# EAGLE board 6502_R8 (EAGLE 7.5.0)
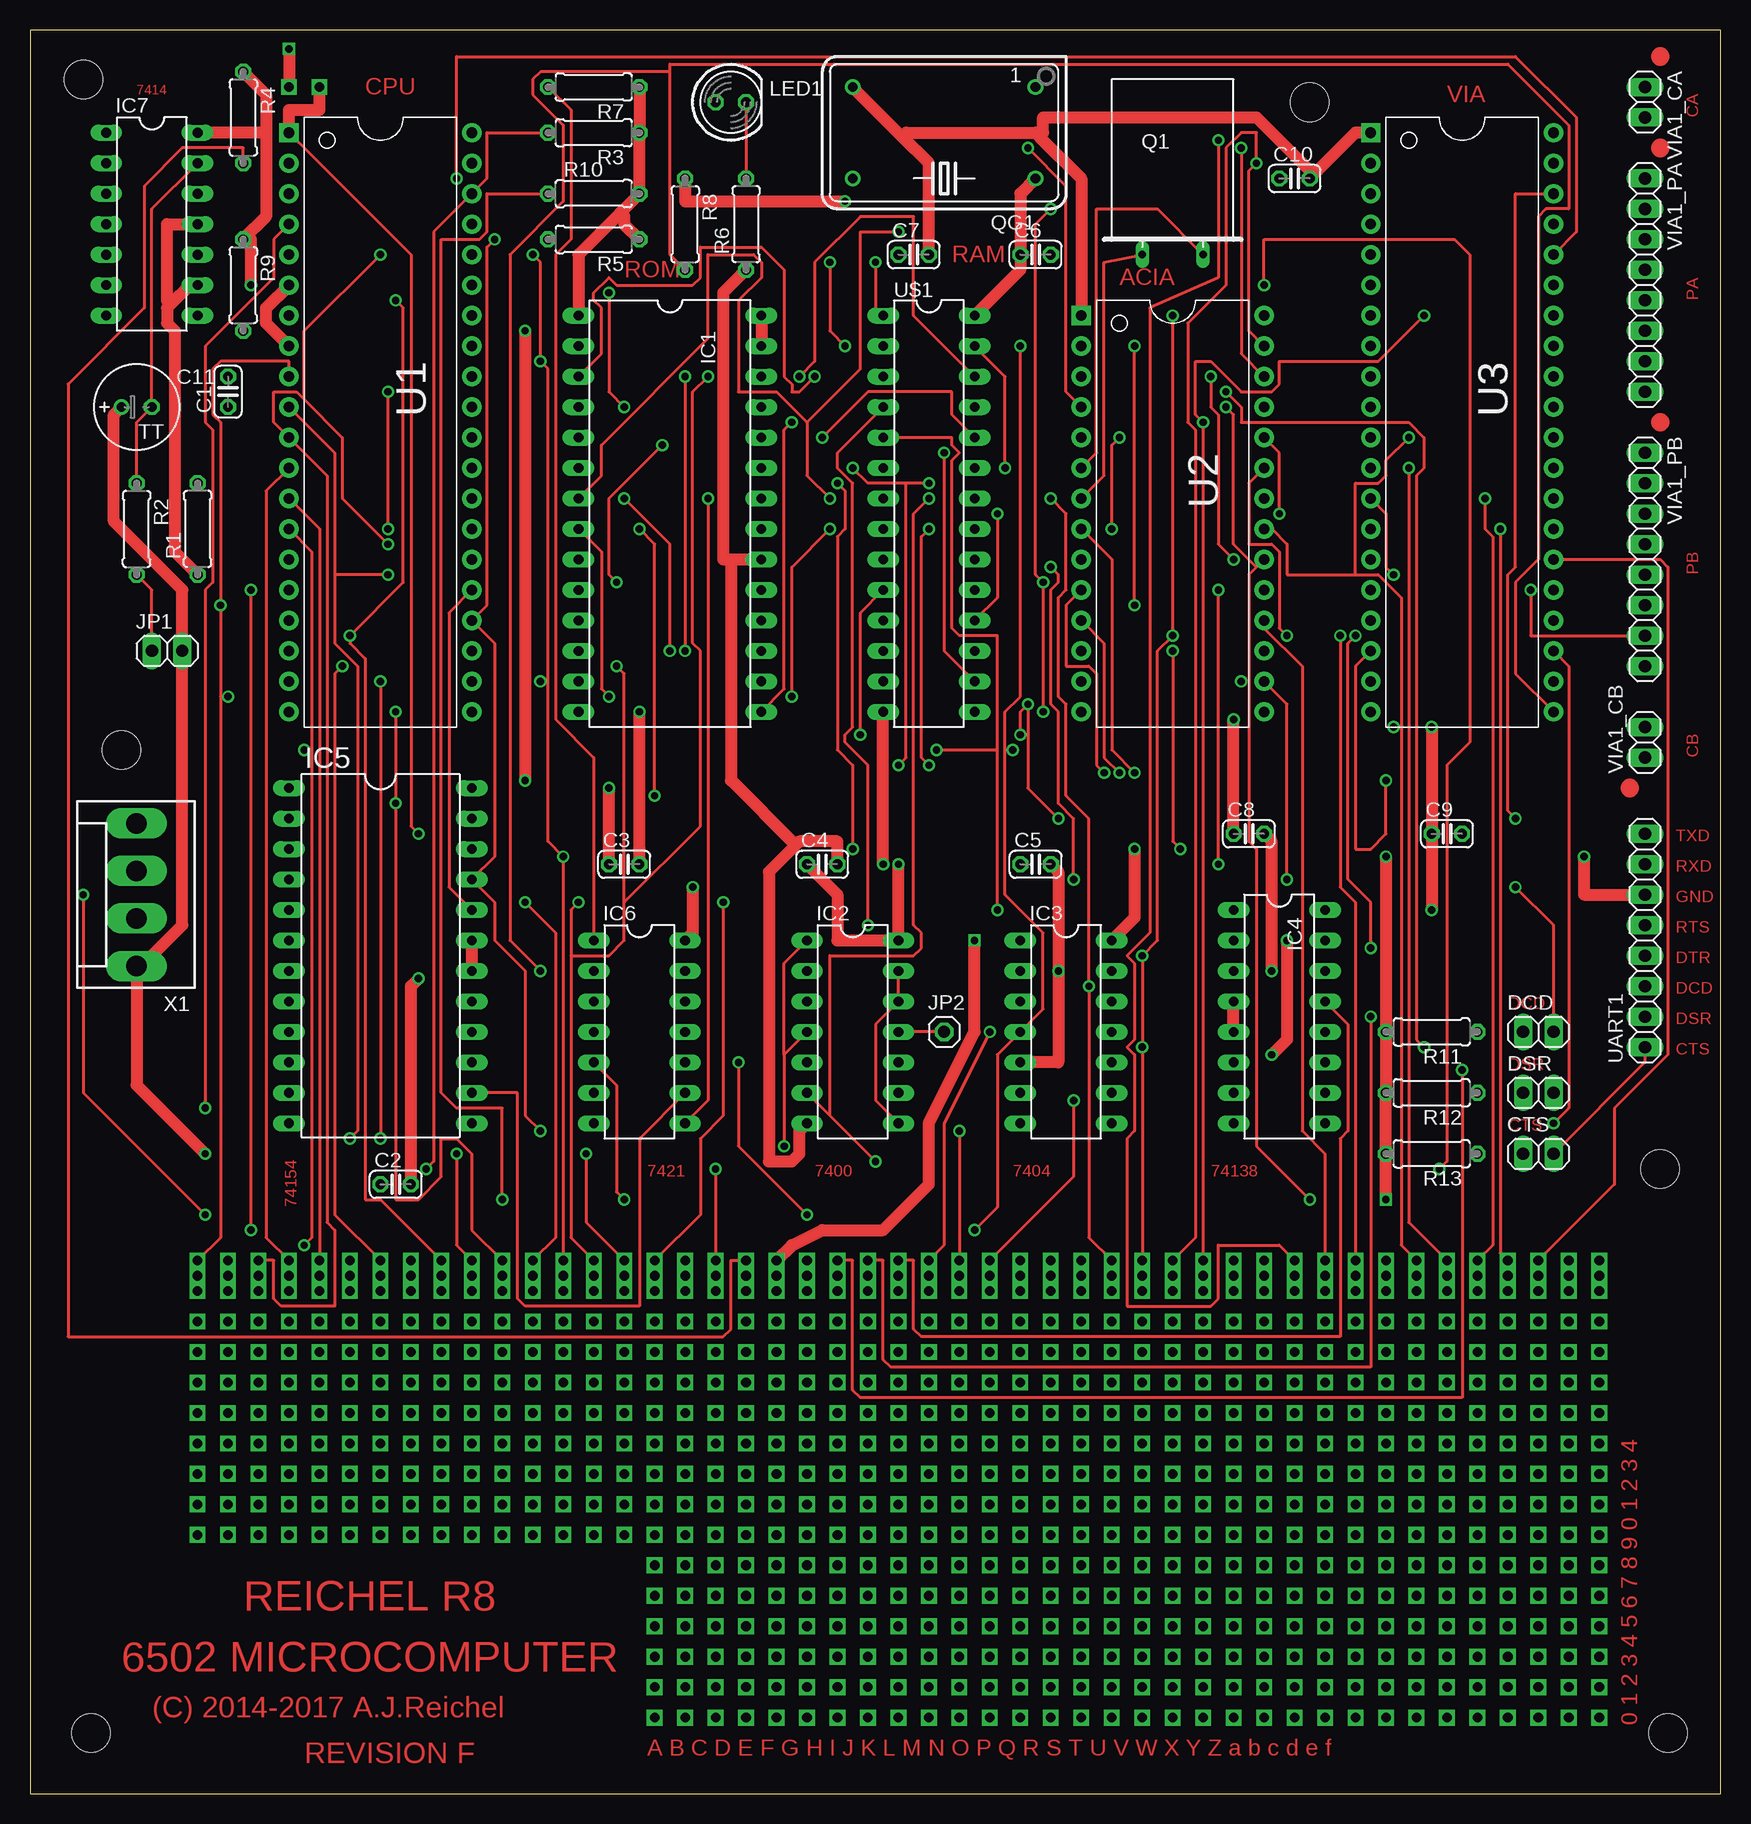
[diagram p1: board, top side]
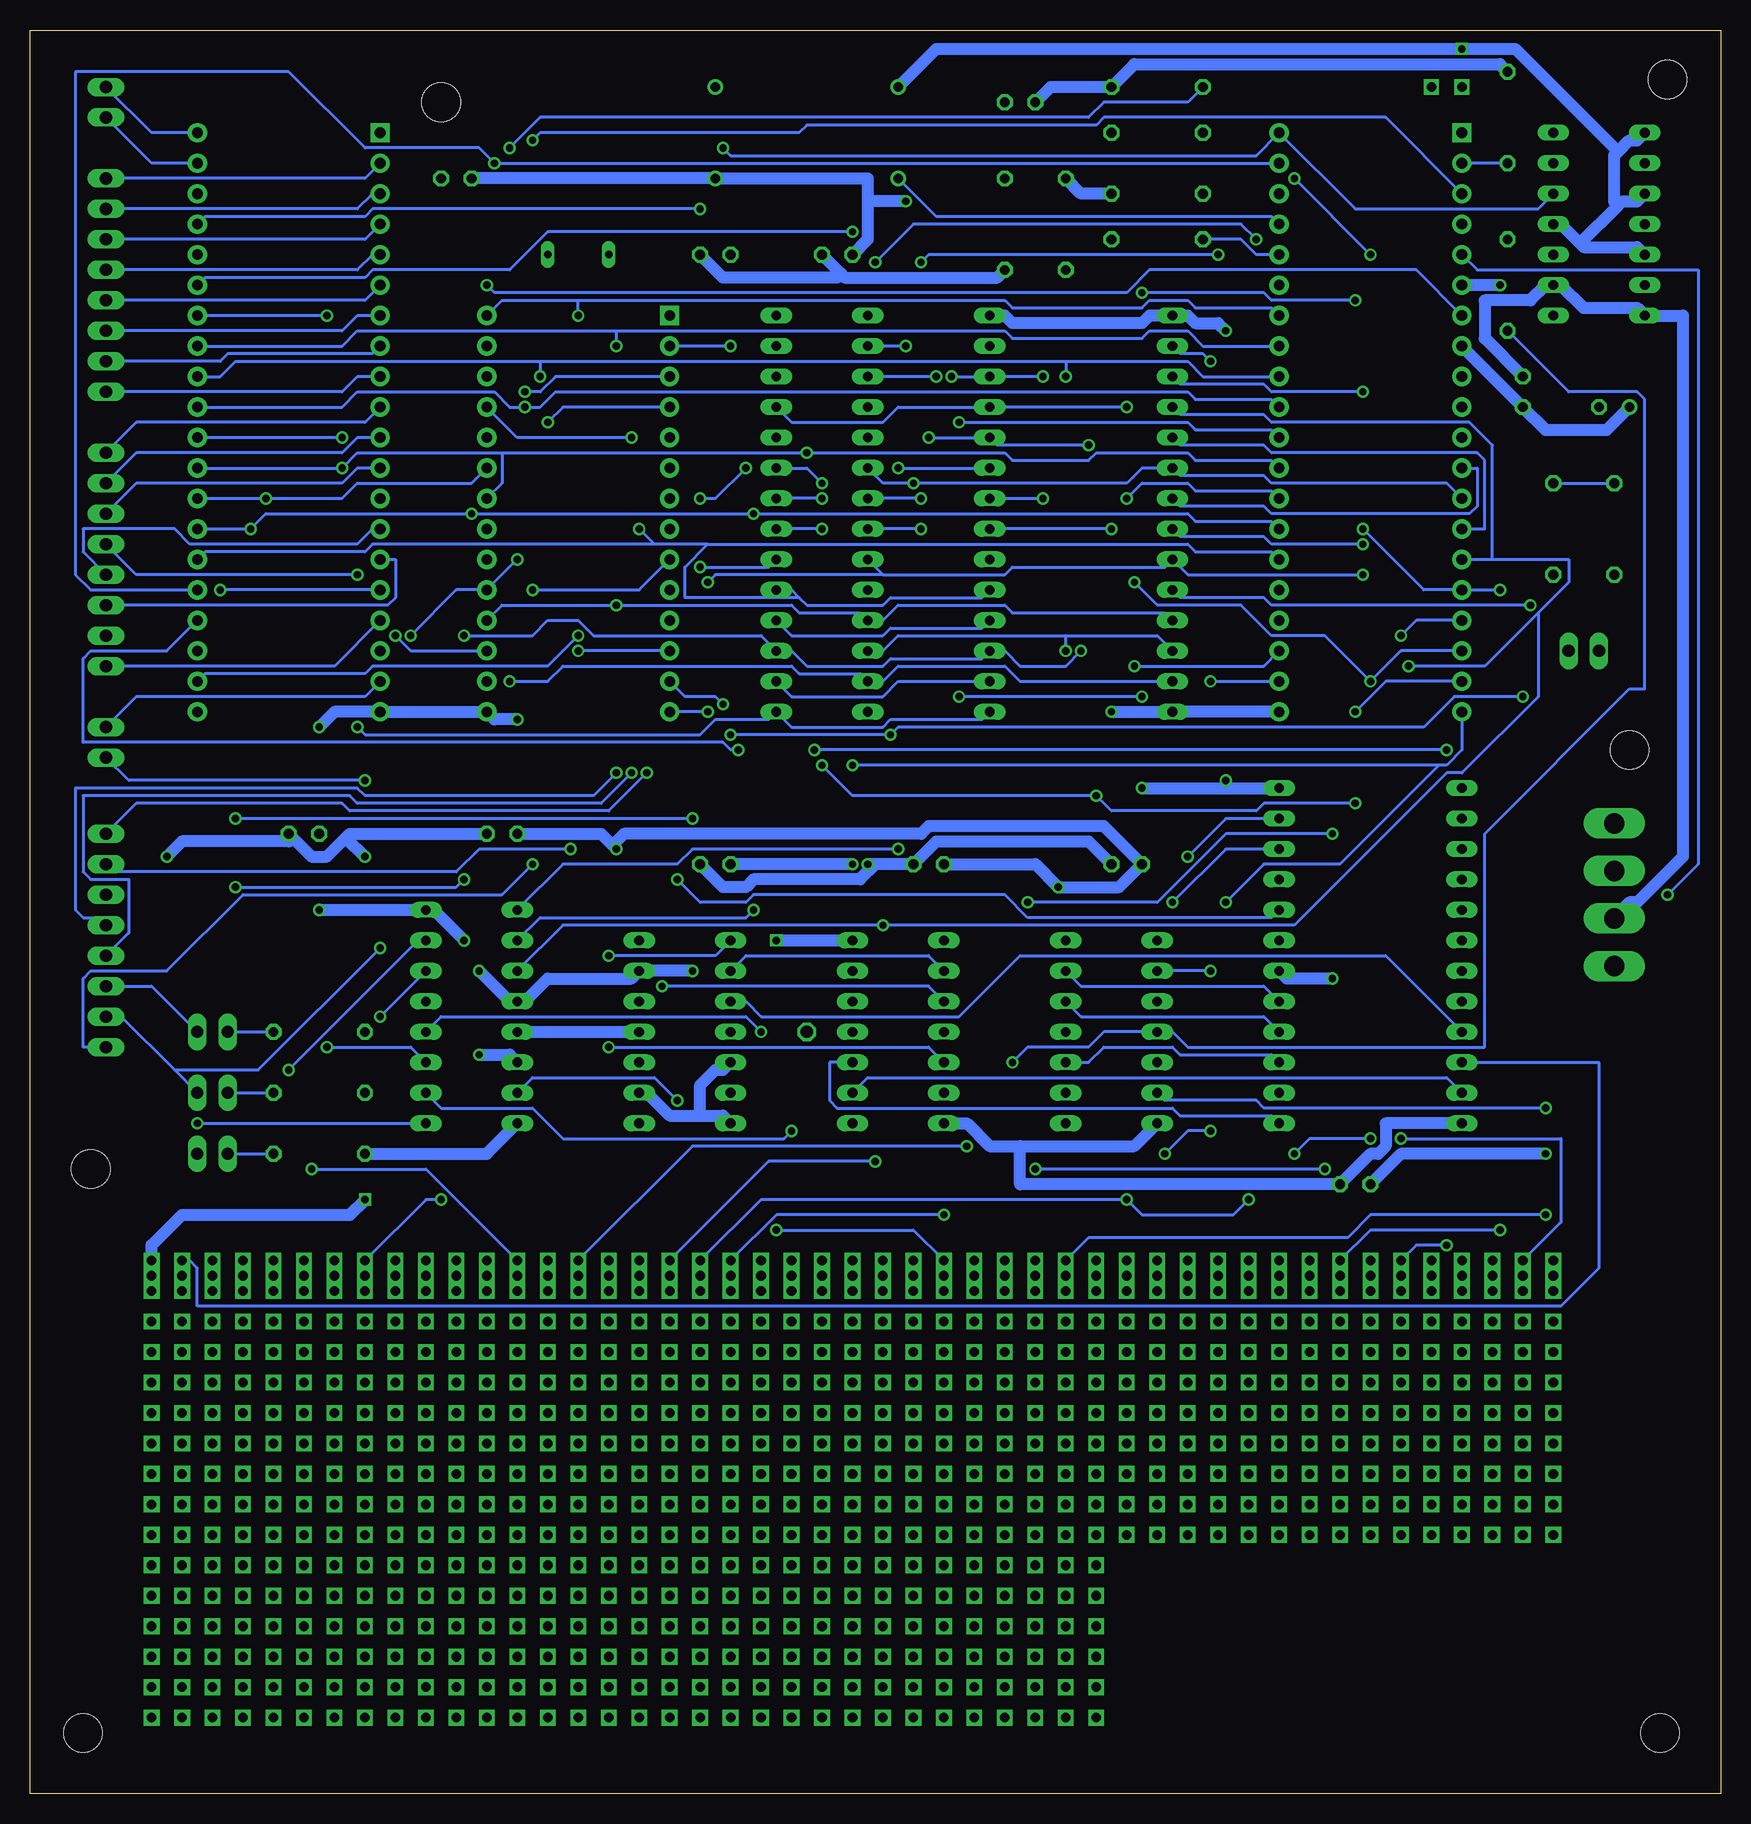
[diagram p2: board, bottom side, seen from below]

Size 140.95 x 146.99 mm. Coordinates in mm from the lower left corner, seen from the top.
Outline: 0,0 140.95,0 140.95,146.99 0,146.99 0,0
Copper layers (1*16): Top 0.035mm / dielectric 1.5mm / Bottom 0.035mm
Design rules "default *": minimum track width 10mil, minimum drill 24mil, track to track 8mil, track to pad 8mil, pad to pad 8mil, via to via 8mil, smd to smd 8mil, copper to edge 40mil, drill to drill 8mil, minimum pad ring 10mil, minimum via ring 8mil, stop-mask expansion 4mil, vias tented up to drill 0mil, thermal gap 10mil
Net classes: 1 Power: width 1.016 mm, drill 0.508 mm, clearance 0.254 mm
Holes 3.2 mm at 5.08,5.08 7.62,87 136.53,5.08 135.89,52.07 106.68,140.97 4.45,142.88

## Footprints (pad centres in the part's own frame; a part is rotated, then mirrored left to right if it is on the bottom)
C025-024X044 = drill 0.813 octagon: 1 -1.27,0; 2 1.27,0
TT2D7 = drill 0.813: + -1.27,0 | drill 0.813 octagon: - 1.27,0
1X02 = drill 1.016 long: 1 -1.27,0; 2 1.27,0
DIL28 = drill 0.813 long: 1 -16.51,-7.62; 2 -13.97,-7.62; 3 -11.43,-7.62; 4 -8.89,-7.62; 5 -6.35,-7.62; 6 -3.81,-7.62; 7 -1.27,-7.62; 8 1.27,-7.62; 9 3.81,-7.62; 10 6.35,-7.62; 11 8.89,-7.62; 12 11.43,-7.62; 13 13.97,-7.62; 14 16.51,-7.62; 15 16.51,7.62; 16 13.97,7.62; 17 11.43,7.62; 18 8.89,7.62; 19 6.35,7.62; 20 3.81,7.62; 21 1.27,7.62; 22 -1.27,7.62; 23 -3.81,7.62; 24 -6.35,7.62; 25 -8.89,7.62; 26 -11.43,7.62; 27 -13.97,7.62; 28 -16.51,7.62
DIL14 = drill 0.813 long: 1 -7.62,-3.81; 2 -5.08,-3.81; 3 -2.54,-3.81; 4 0,-3.81; 5 2.54,-3.81; 6 5.08,-3.81; 7 7.62,-3.81; 8 7.62,3.81; 9 5.08,3.81; 10 2.54,3.81; 11 0,3.81; 12 -2.54,3.81; 13 -5.08,3.81; 14 -7.62,3.81
DIL16 = drill 0.813 long: 1 -8.89,-3.81; 2 -6.35,-3.81; 3 -3.81,-3.81; 4 -1.27,-3.81; 5 1.27,-3.81; 6 3.81,-3.81; 7 6.35,-3.81; 8 8.89,-3.81; 9 8.89,3.81; 10 6.35,3.81; 11 3.81,3.81; 12 1.27,3.81; 13 -1.27,3.81; 14 -3.81,3.81; 15 -6.35,3.81; 16 -8.89,3.81
DIL24-6 = drill 0.813 long: 1 -13.97,-7.62; 2 -11.43,-7.62; 3 -8.89,-7.62; 4 -6.35,-7.62; 5 -3.81,-7.62; 6 -1.27,-7.62; 7 1.27,-7.62; 8 3.81,-7.62; 9 6.35,-7.62; 10 8.89,-7.62; 11 11.43,-7.62; 12 13.97,-7.62; 13 13.97,7.62; 14 11.43,7.62; 15 8.89,7.62; 16 6.35,7.62; 17 3.81,7.62; 18 1.27,7.62; 19 -1.27,7.62; 20 -3.81,7.62; 21 -6.35,7.62; 22 -8.89,7.62; 23 -11.43,7.62; 24 -13.97,7.62
1X01 = drill 1.016 octagon: 1 0,0
LED5MM = drill 0.813 octagon: A -1.27,0; K 1.27,0
Q = drill 0.61 long: 1 -2.54,-7.62; 2 2.54,-7.62
DIL14S = drill 0.813: 1 -7.62,-3.81; 7 7.62,-3.81; 8 7.62,3.81; 14 -7.62,3.81
0207/7 = drill 0.813 octagon: 1 -3.81,0; 2 3.81,0
DIP-40 = drill 0.889 pad 1.6 square: 1 -22.86,-7.62 | drill 0.889 pad 1.6: 2 -20.32,-7.62; 3 -17.78,-7.62; 4 -15.24,-7.62; 5 -12.7,-7.62; 6 -10.16,-7.62; 7 -7.62,-7.62; 8 -5.08,-7.62; 9 -2.54,-7.62; 10 0,-7.62; 11 2.54,-7.62; 12 5.08,-7.62; 13 7.62,-7.62; 14 10.16,-7.62; 15 12.7,-7.62; 16 15.24,-7.62; 17 17.78,-7.62; 18 20.32,-7.62; 19 22.86,-7.62; 20 25.4,-7.62; 21 25.4,7.62; 22 22.86,7.62; 23 20.32,7.62; 24 17.78,7.62; 25 15.24,7.62; 26 12.7,7.62; 27 10.16,7.62; 28 7.62,7.62; 29 5.08,7.62; 30 2.54,7.62; 31 0,7.62; 32 -2.54,7.62; 33 -5.08,7.62; 34 -7.62,7.62; 35 -10.16,7.62; 36 -12.7,7.62; 37 -15.24,7.62; 38 -17.78,7.62; 39 -20.32,7.62; 40 -22.86,7.62
DIP-28 = drill 0.889 pad 1.6 square: 1 -15.24,-7.62 | drill 0.889 pad 1.6: 2 -12.7,-7.62; 3 -10.16,-7.62; 4 -7.62,-7.62; 5 -5.08,-7.62; 6 -2.54,-7.62; 7 0,-7.62; 8 2.54,-7.62; 9 5.08,-7.62; 10 7.62,-7.62; 11 10.16,-7.62; 12 12.7,-7.62; 13 15.24,-7.62; 14 17.78,-7.62; 15 17.78,7.62; 16 15.24,7.62; 17 12.7,7.62; 18 10.16,7.62; 19 7.62,7.62; 20 5.08,7.62; 21 2.54,7.62; 22 0,7.62; 23 -2.54,7.62; 24 -5.08,7.62; 25 -7.62,7.62; 26 -10.16,7.62; 27 -12.7,7.62; 28 -15.24,7.62
DIL28-3 = drill 0.813 long: 1 -16.51,-3.81; 2 -13.97,-3.81; 3 -11.43,-3.81; 4 -8.89,-3.81; 5 -6.35,-3.81; 6 -3.81,-3.81; 7 -1.27,-3.81; 8 1.27,-3.81; 9 3.81,-3.81; 10 6.35,-3.81; 11 8.89,-3.81; 12 11.43,-3.81; 13 13.97,-3.81; 14 16.51,-3.81; 15 16.51,3.81; 16 13.97,3.81; 17 11.43,3.81; 18 8.89,3.81; 19 6.35,3.81; 20 3.81,3.81; 21 1.27,3.81; 22 -1.27,3.81; 23 -3.81,3.81; 24 -6.35,3.81; 25 -8.89,3.81; 26 -11.43,3.81; 27 -13.97,3.81; 28 -16.51,3.81
SOLDERPAD = drill 0.8 square: P$1 -13.97,6.35; P$2 -11.43,6.35; P$3 -8.89,6.35; P$4 -6.35,6.35; P$5 -3.81,6.35; P$6 -1.27,6.35; P$7 1.27,6.35; P$8 3.81,6.35; P$9 6.35,6.35; P$10 8.89,6.35; P$11 11.43,6.35; P$12 13.97,6.35; P$13 16.51,6.35; P$14 19.05,6.35; P$15 21.59,6.35; P$16 24.13,6.35; P$17 -16.51,6.35; P$18 -19.05,6.35; P$19 -21.59,6.35; P$20 -24.13,6.35; P$21 26.67,6.35; P$22 29.21,6.35; P$23 31.75,6.35; P$24 34.29,6.35; P$25 36.83,6.35; P$26 39.37,6.35; P$27 41.91,6.35; P$28 44.45,6.35; P$29 46.99,6.35; P$30 49.53,6.35; P$31 52.07,6.35; P$32 54.61,6.35; P$33 -24.13,3.81; P$34 -13.97,3.81; P$35 -11.43,3.81; P$36 -8.89,3.81; P$37 -6.35,3.81; P$38 -3.81,3.81; P$39 -1.27,3.81; P$40 1.27,3.81; P$41 3.81,3.81; P$42 6.35,3.81; P$43 8.89,3.81; P$44 11.43,3.81; P$45 13.97,3.81; P$46 16.51,3.81; P$47 19.05,3.81; P$48 21.59,3.81; P$49 24.13,3.81; P$50 -16.51,3.81; P$51 -19.05,3.81; P$52 -21.59,3.81; P$53 26.67,3.81; P$54 29.21,3.81; P$55 31.75,3.81; P$56 34.29,3.81; P$57 36.83,3.81; P$58 39.37,3.81; P$59 41.91,3.81; P$60 44.45,3.81; P$61 46.99,3.81; P$62 49.53,3.81; P$63 52.07,3.81; P$64 54.61,3.81; P$65 -13.97,1.27; P$66 -11.43,1.27; P$67 -8.89,1.27; P$68 -6.35,1.27; P$69 -3.81,1.27; P$70 -1.27,1.27; P$71 1.27,1.27; P$72 3.81,1.27; P$73 6.35,1.27; P$74 8.89,1.27; P$75 11.43,1.27; P$76 13.97,1.27; P$77 16.51,1.27; P$78 19.05,1.27; P$79 21.59,1.27; P$80 24.13,1.27; P$81 -16.51,1.27; P$82 -19.05,1.27; P$83 -21.59,1.27; P$84 -24.13,1.27; P$85 26.67,1.27; P$86 29.21,1.27; P$87 31.75,1.27; P$88 34.29,1.27; P$89 36.83,1.27; P$90 39.37,1.27; P$91 41.91,1.27; P$92 44.45,1.27; P$93 46.99,1.27; P$94 49.53,1.27; P$95 52.07,1.27; P$96 54.61,1.27; P$97 -24.13,-1.27; P$98 -13.97,-1.27; P$99 -11.43,-1.27; P$100 -8.89,-1.27; P$101 -6.35,-1.27; P$102 -3.81,-1.27; P$103 -1.27,-1.27; P$104 1.27,-1.27; P$105 3.81,-1.27; P$106 6.35,-1.27; P$107 8.89,-1.27; P$108 11.43,-1.27; P$109 13.97,-1.27; P$110 16.51,-1.27; P$111 19.05,-1.27; P$112 21.59,-1.27; P$113 24.13,-1.27; P$114 -16.51,-1.27; P$115 -19.05,-1.27; P$116 -21.59,-1.27; P$117 26.67,-1.27; P$118 29.21,-1.27; P$119 31.75,-1.27; P$120 34.29,-1.27; P$121 36.83,-1.27; P$122 39.37,-1.27; P$123 41.91,-1.27; P$124 44.45,-1.27; P$125 46.99,-1.27; P$126 49.53,-1.27; P$127 52.07,-1.27; P$128 54.61,-1.27; P$129 -13.97,-3.81; P$130 -11.43,-3.81; P$131 -8.89,-3.81; P$132 -6.35,-3.81; P$133 -3.81,-3.81; P$134 -1.27,-3.81; P$135 1.27,-3.81; P$136 3.81,-3.81; P$137 6.35,-3.81; P$138 8.89,-3.81; P$139 11.43,-3.81; P$140 13.97,-3.81; P$141 16.51,-3.81; P$142 19.05,-3.81; P$143 21.59,-3.81; P$144 24.13,-3.81; P$145 -16.51,-3.81; P$146 -19.05,-3.81; P$147 -21.59,-3.81; P$148 -24.13,-3.81; P$149 26.67,-3.81; P$150 29.21,-3.81; P$151 31.75,-3.81; P$152 34.29,-3.81; P$153 36.83,-3.81; P$154 39.37,-3.81; P$155 41.91,-3.81; P$156 44.45,-3.81; P$157 46.99,-3.81; P$158 49.53,-3.81; P$159 52.07,-3.81; P$160 54.61,-3.81; P$161 -24.13,-6.35; P$162 -13.97,-6.35; P$163 -11.43,-6.35; P$164 -8.89,-6.35; P$165 -6.35,-6.35; P$166 -3.81,-6.35; P$167 -1.27,-6.35; P$168 1.27,-6.35; P$169 3.81,-6.35; P$170 6.35,-6.35; P$171 8.89,-6.35; P$172 11.43,-6.35; P$173 13.97,-6.35; P$174 16.51,-6.35; P$175 19.05,-6.35; P$176 21.59,-6.35; P$177 24.13,-6.35; P$178 -16.51,-6.35; P$179 -19.05,-6.35; P$180 -21.59,-6.35; P$181 26.67,-6.35; P$182 29.21,-6.35; P$183 31.75,-6.35; P$184 34.29,-6.35; P$185 36.83,-6.35; P$186 39.37,-6.35; P$187 41.91,-6.35; P$188 44.45,-6.35; P$189 46.99,-6.35; P$190 49.53,-6.35; P$191 52.07,-6.35; P$192 54.61,-6.35; P$193 -13.97,-8.89; P$194 -11.43,-8.89; P$195 -8.89,-8.89; P$196 -6.35,-8.89; P$197 -3.81,-8.89; P$198 -1.27,-8.89; P$199 1.27,-8.89; P$200 3.81,-8.89; P$201 6.35,-8.89; P$202 8.89,-8.89; P$203 11.43,-8.89; P$204 13.97,-8.89; P$205 16.51,-8.89; P$206 19.05,-8.89; P$207 21.59,-8.89; P$208 24.13,-8.89; P$209 -16.51,-8.89; P$210 -19.05,-8.89; P$211 -21.59,-8.89; P$212 -24.13,-8.89; P$213 26.67,-8.89; P$214 29.21,-8.89; P$215 31.75,-8.89; P$216 34.29,-8.89; P$217 36.83,-8.89; P$218 39.37,-8.89; P$219 41.91,-8.89; P$220 44.45,-8.89; P$221 46.99,-8.89; P$222 49.53,-8.89; P$223 52.07,-8.89; P$224 54.61,-8.89; P$225 -24.13,-11.43; P$226 -13.97,-11.43; P$227 -11.43,-11.43; P$228 -8.89,-11.43; P$229 -6.35,-11.43; P$230 -3.81,-11.43; P$231 -1.27,-11.43; P$232 1.27,-11.43; P$233 3.81,-11.43; P$234 6.35,-11.43; P$235 8.89,-11.43; P$236 11.43,-11.43; P$237 13.97,-11.43; P$238 16.51,-11.43; P$239 19.05,-11.43; P$240 21.59,-11.43; P$241 24.13,-11.43; P$242 -16.51,-11.43; P$243 -19.05,-11.43; P$244 -21.59,-11.43; P$245 26.67,-11.43; P$246 29.21,-11.43; P$247 31.75,-11.43; P$248 34.29,-11.43; P$249 36.83,-11.43; P$250 39.37,-11.43; P$251 41.91,-11.43; P$252 44.45,-11.43; P$253 46.99,-11.43; P$254 49.53,-11.43; P$255 52.07,-11.43; P$256 54.61,-11.43; P$257 -13.97,-13.97; P$258 -11.43,-13.97; P$259 -8.89,-13.97; P$260 -6.35,-13.97; P$261 -3.81,-13.97; P$262 -1.27,-13.97; P$263 1.27,-13.97; P$264 3.81,-13.97; P$265 6.35,-13.97; P$266 8.89,-13.97; P$267 11.43,-13.97; P$268 13.97,-13.97; P$269 16.51,-13.97; P$270 19.05,-13.97; P$271 21.59,-13.97; P$272 24.13,-13.97; P$273 -16.51,-13.97; P$274 -19.05,-13.97; P$275 -21.59,-13.97; P$276 -24.13,-13.97; P$277 26.67,-13.97; P$278 29.21,-13.97; P$279 31.75,-13.97; P$280 34.29,-13.97; P$281 36.83,-13.97; P$282 39.37,-13.97; P$283 41.91,-13.97; P$284 44.45,-13.97; P$285 46.99,-13.97; P$286 49.53,-13.97; P$287 52.07,-13.97; P$288 54.61,-13.97; P$289 -24.13,-16.51; P$290 -13.97,-16.51; P$291 -11.43,-16.51; P$292 -8.89,-16.51; P$293 -6.35,-16.51; P$294 -3.81,-16.51; P$295 -1.27,-16.51; P$296 1.27,-16.51; P$297 3.81,-16.51; P$298 6.35,-16.51; P$299 8.89,-16.51; P$300 11.43,-16.51; P$301 13.97,-16.51; P$302 16.51,-16.51; P$303 19.05,-16.51; P$304 21.59,-16.51; P$305 24.13,-16.51; P$306 -16.51,-16.51; P$307 -19.05,-16.51; P$308 -21.59,-16.51; P$309 26.67,-16.51; P$310 29.21,-16.51; P$311 31.75,-16.51; P$312 34.29,-16.51; P$313 36.83,-16.51; P$314 39.37,-16.51; P$315 41.91,-16.51; P$316 44.45,-16.51; P$317 46.99,-16.51; P$318 49.53,-16.51; P$319 52.07,-16.51; P$320 54.61,-16.51; P$321 -13.97,-19.05; P$322 -11.43,-19.05; P$323 -8.89,-19.05; P$324 -6.35,-19.05; P$325 -3.81,-19.05; P$326 -1.27,-19.05; P$327 1.27,-19.05; P$328 3.81,-19.05; P$329 6.35,-19.05; P$330 8.89,-19.05; P$331 11.43,-19.05; P$332 13.97,-19.05; P$333 16.51,-19.05; P$334 19.05,-19.05; P$335 21.59,-19.05; P$336 24.13,-19.05; P$337 -16.51,-19.05; P$338 -19.05,-19.05; P$339 -21.59,-19.05; P$340 -24.13,-19.05; P$341 26.67,-19.05; P$342 29.21,-19.05; P$343 31.75,-19.05; P$344 34.29,-19.05; P$345 36.83,-19.05; P$346 39.37,-19.05; P$347 41.91,-19.05; P$348 44.45,-19.05; P$349 46.99,-19.05; P$350 49.53,-19.05; P$351 52.07,-19.05; P$352 54.61,-19.05; P$353 -24.13,-21.59; P$354 -13.97,-21.59; P$355 -11.43,-21.59; P$356 -8.89,-21.59; P$357 -6.35,-21.59; P$358 -3.81,-21.59; P$359 -1.27,-21.59; P$360 1.27,-21.59; P$361 3.81,-21.59; P$362 6.35,-21.59; P$363 8.89,-21.59; P$364 11.43,-21.59; P$365 13.97,-21.59; P$366 16.51,-21.59; P$367 19.05,-21.59; P$368 21.59,-21.59; P$369 24.13,-21.59; P$370 -16.51,-21.59; P$371 -19.05,-21.59; P$372 -21.59,-21.59; P$373 26.67,-21.59; P$374 29.21,-21.59; P$375 31.75,-21.59; P$376 34.29,-21.59; P$377 36.83,-21.59; P$378 39.37,-21.59; P$379 41.91,-21.59; P$380 44.45,-21.59; P$381 46.99,-21.59; P$382 49.53,-21.59; P$383 52.07,-21.59; P$384 54.61,-21.59; P$385 -13.97,-24.13; P$386 -11.43,-24.13; P$387 -8.89,-24.13; P$388 -6.35,-24.13; P$389 -3.81,-24.13; P$390 -1.27,-24.13; P$391 1.27,-24.13; P$392 3.81,-24.13; P$393 6.35,-24.13; P$394 8.89,-24.13; P$395 11.43,-24.13; P$396 13.97,-24.13; P$397 16.51,-24.13; P$398 19.05,-24.13; P$399 21.59,-24.13; P$400 24.13,-24.13; P$401 -16.51,-24.13; P$402 -19.05,-24.13; P$403 -21.59,-24.13; P$404 -24.13,-24.13; P$405 26.67,-24.13; P$406 29.21,-24.13; P$407 31.75,-24.13; P$408 34.29,-24.13; P$409 36.83,-24.13; P$410 39.37,-24.13; P$411 41.91,-24.13; P$412 44.45,-24.13; P$413 46.99,-24.13; P$414 49.53,-24.13; P$415 52.07,-24.13; P$416 54.61,-24.13; P$417 -24.13,-26.67; P$418 -13.97,-26.67; P$419 -11.43,-26.67; P$420 -8.89,-26.67; P$421 -6.35,-26.67; P$422 -3.81,-26.67; P$423 -1.27,-26.67; P$424 1.27,-26.67; P$425 3.81,-26.67; P$426 6.35,-26.67; P$427 8.89,-26.67; P$428 11.43,-26.67; P$429 13.97,-26.67; P$430 16.51,-26.67; P$431 19.05,-26.67; P$432 21.59,-26.67; P$433 24.13,-26.67; P$434 -16.51,-26.67; P$435 -19.05,-26.67; P$436 -21.59,-26.67; P$437 26.67,-26.67; P$438 29.21,-26.67; P$439 31.75,-26.67; P$440 34.29,-26.67; P$441 36.83,-26.67; P$442 39.37,-26.67; P$443 41.91,-26.67; P$444 44.45,-26.67; P$445 46.99,-26.67; P$446 49.53,-26.67; P$447 52.07,-26.67; P$448 54.61,-26.67; P$449 -13.97,-29.21; P$450 -11.43,-29.21; P$451 -8.89,-29.21; P$452 -6.35,-29.21; P$453 -3.81,-29.21; P$454 -1.27,-29.21; P$455 1.27,-29.21; P$456 3.81,-29.21; P$457 6.35,-29.21; P$458 8.89,-29.21; P$459 11.43,-29.21; P$460 13.97,-29.21; P$461 16.51,-29.21; P$462 19.05,-29.21; P$463 21.59,-29.21; P$464 24.13,-29.21; P$465 -16.51,-29.21; P$466 -19.05,-29.21; P$467 -21.59,-29.21; P$468 -24.13,-29.21; P$469 26.67,-29.21; P$470 29.21,-29.21; P$471 31.75,-29.21; P$472 34.29,-29.21; P$473 36.83,-29.21; P$474 39.37,-29.21; P$475 41.91,-29.21; P$476 44.45,-29.21; P$477 46.99,-29.21; P$478 49.53,-29.21; P$479 52.07,-29.21; P$480 54.61,-29.21; P$481 -24.13,-31.75; P$482 -13.97,-31.75; P$483 -11.43,-31.75; P$484 -8.89,-31.75; P$485 -6.35,-31.75; P$486 -3.81,-31.75; P$487 -1.27,-31.75; P$488 1.27,-31.75; P$489 3.81,-31.75; P$490 6.35,-31.75; P$491 8.89,-31.75; P$492 11.43,-31.75; P$493 13.97,-31.75; P$494 16.51,-31.75; P$495 19.05,-31.75; P$496 21.59,-31.75; P$497 24.13,-31.75; P$498 -16.51,-31.75; P$499 -19.05,-31.75; P$500 -21.59,-31.75; P$501 26.67,-31.75; P$502 29.21,-31.75; P$503 31.75,-31.75; P$504 34.29,-31.75; P$505 36.83,-31.75; P$506 39.37,-31.75; P$507 41.91,-31.75; P$508 44.45,-31.75; P$509 46.99,-31.75; P$510 49.53,-31.75; P$511 52.07,-31.75; P$512 54.61,-31.75; P$513 -24.13,5.08; P$514 -21.59,5.08; P$515 -19.05,5.08; P$516 -16.51,5.08; P$517 -13.97,5.08; P$518 -11.43,5.08; P$519 -8.89,5.08; P$520 -6.35,5.08; P$521 -3.81,5.08; P$522 -1.27,5.08; P$523 1.27,5.08; P$524 3.81,5.08; P$525 6.35,5.08; P$526 8.89,5.08; P$527 11.43,5.08; P$528 13.97,5.08; P$529 16.51,5.08; P$530 19.05,5.08; P$531 21.59,5.08; P$532 24.13,5.08; P$533 26.67,5.08; P$534 29.21,5.08; P$535 31.75,5.08; P$536 34.29,5.08; P$537 36.83,5.08; P$538 39.37,5.08; P$539 41.91,5.08; P$540 44.45,5.08; P$541 46.99,5.08; P$542 49.53,5.08; P$543 52.07,5.08; P$544 54.61,5.08
SOLDERPAD2 = drill 0.8 square: P$1 -27.94,7.62; P$2 -25.4,7.62; P$3 -22.86,7.62; P$4 -20.32,7.62; P$5 -17.78,7.62; P$6 -15.24,7.62; P$7 -12.7,7.62; P$8 -10.16,7.62; P$9 -7.62,7.62; P$10 -5.08,7.62; P$11 -2.54,7.62; P$12 0,7.62; P$13 2.54,7.62; P$14 5.08,7.62; P$15 7.62,7.62; P$16 -27.94,6.35; P$17 -25.4,6.35; P$18 -22.86,6.35; P$19 -20.32,6.35; P$20 -17.78,6.35; P$21 -15.24,6.35; P$22 -12.7,6.35; P$23 -10.16,6.35; P$24 -7.62,6.35; P$25 -5.08,6.35; P$26 -2.54,6.35; P$27 0,6.35; P$28 2.54,6.35; P$29 5.08,6.35; P$30 7.62,6.35; P$31 -27.94,5.08; P$32 -25.4,5.08; P$33 -22.86,5.08; P$34 -20.32,5.08; P$35 -17.78,5.08; P$36 -15.24,5.08; P$37 -12.7,5.08; P$38 -10.16,5.08; P$39 -7.62,5.08; P$40 -5.08,5.08; P$41 -2.54,5.08; P$42 0,5.08; P$43 2.54,5.08; P$44 5.08,5.08; P$45 7.62,5.08; P$46 -27.94,2.54; P$47 -25.4,2.54; P$48 -22.86,2.54; P$49 -20.32,2.54; P$50 -17.78,2.54; P$51 -15.24,2.54; P$52 -12.7,2.54; P$53 -10.16,2.54; P$54 -7.62,2.54; P$55 -5.08,2.54; P$56 -2.54,2.54; P$57 0,2.54; P$58 2.54,2.54; P$59 5.08,2.54; P$60 7.62,2.54; P$61 -27.94,0; P$62 -25.4,0; P$63 -22.86,0; P$64 -20.32,0; P$65 -17.78,0; P$66 -15.24,0; P$67 -12.7,0; P$68 -10.16,0; P$69 -7.62,0; P$70 -5.08,0; P$71 -2.54,0; P$72 0,0; P$73 2.54,0; P$74 5.08,0; P$75 7.62,0; P$76 -27.94,-2.54; P$77 -25.4,-2.54; P$78 -22.86,-2.54; P$79 -20.32,-2.54; P$80 -17.78,-2.54; P$81 -15.24,-2.54; P$82 -12.7,-2.54; P$83 -10.16,-2.54; P$84 -7.62,-2.54; P$85 -5.08,-2.54; P$86 -2.54,-2.54; P$87 0,-2.54; P$88 2.54,-2.54; P$89 5.08,-2.54; P$90 7.62,-2.54; P$91 -27.94,-5.08; P$92 -25.4,-5.08; P$93 -22.86,-5.08; P$94 -20.32,-5.08; P$95 -17.78,-5.08; P$96 -15.24,-5.08; P$97 -12.7,-5.08; P$98 -10.16,-5.08; P$99 -7.62,-5.08; P$100 -5.08,-5.08; P$101 -2.54,-5.08; P$102 0,-5.08; P$103 2.54,-5.08; P$104 5.08,-5.08; P$105 7.62,-5.08; P$106 -27.94,-7.62; P$107 -25.4,-7.62; P$108 -22.86,-7.62; P$109 -20.32,-7.62; P$110 -17.78,-7.62; P$111 -15.24,-7.62; P$112 -12.7,-7.62; P$113 -10.16,-7.62; P$114 -7.62,-7.62; P$115 -5.08,-7.62; P$116 -2.54,-7.62; P$117 0,-7.62; P$118 2.54,-7.62; P$119 5.08,-7.62; P$120 7.62,-7.62; P$121 -27.94,-10.16; P$122 -25.4,-10.16; P$123 -22.86,-10.16; P$124 -20.32,-10.16; P$125 -17.78,-10.16; P$126 -15.24,-10.16; P$127 -12.7,-10.16; P$128 -10.16,-10.16; P$129 -7.62,-10.16; P$130 -5.08,-10.16; P$131 -2.54,-10.16; P$132 0,-10.16; P$133 2.54,-10.16; P$134 5.08,-10.16; P$135 7.62,-10.16; P$136 -27.94,-12.7; P$137 -25.4,-12.7; P$138 -22.86,-12.7; P$139 -20.32,-12.7; P$140 -17.78,-12.7; P$141 -15.24,-12.7; P$142 -12.7,-12.7; P$143 -10.16,-12.7; P$144 -7.62,-12.7; P$145 -5.08,-12.7; P$146 -2.54,-12.7; P$147 0,-12.7; P$148 2.54,-12.7; P$149 5.08,-12.7; P$150 7.62,-12.7; P$151 -27.94,-15.24; P$152 -25.4,-15.24; P$153 -22.86,-15.24; P$154 -20.32,-15.24; P$155 -17.78,-15.24; P$156 -15.24,-15.24; P$157 -12.7,-15.24; P$158 -10.16,-15.24; P$159 -7.62,-15.24; P$160 -5.08,-15.24; P$161 -2.54,-15.24; P$162 0,-15.24; P$163 2.54,-15.24; P$164 5.08,-15.24; P$165 7.62,-15.24
1X08 = drill 1.016 long: 1 -8.89,0; 2 -6.35,0; 3 -3.81,0; 4 -1.27,0; 5 1.27,0; 6 3.81,0; 7 6.35,0; 8 8.89,0
KK-156-4 = drill 1.7 pad 2.184 long: 1 -5.94,0; 2 -1.98,0; 3 1.98,0; 4 5.94,0

## Placement (x,y rotation side)
C1  [C025-024X044]  16.51,116.84 90 top
C2  [C025-024X044]  30.48,50.8 0 top
C3  [C025-024X044]  49.53,77.47 0 top
C4  [C025-024X044]  66.04,77.47 0 top
C5  [C025-024X044]  83.82,77.47 0 top
C6  [C025-024X044]  83.82,128.27 0 top
C7  [C025-024X044]  73.66,128.27 0 top
C8  [C025-024X044]  101.6,80.01 0 top
C9  [C025-024X044]  118.11,80.01 0 top
C10  [C025-024X044]  105.41,134.62 0 top
C11  [TT2D7]  8.89,115.57 0 top
CTS  [1X02]  125.73,53.34 0 top
DCD  [1X02]  125.73,63.5 0 top
DSR  [1X02]  125.73,58.42 0 top
IC1  27128_OS_ROM  [DIL28]  53.34,106.68 270 top
IC2  74HCT00N  [DIL14]  68.58,63.5 270 top
IC3  74HCT04N  [DIL14]  86.36,63.5 270 top
IC4  74LS138  [DIL16]  104.14,64.77 270 top
IC5  74HCT154N  [DIL24-6]  29.21,69.85 270 top
IC6  74HCT21N  [DIL14]  50.8,63.5 270 top
IC7  74HCT14N  [DIL14]  10.16,130.81 270 top
JP1  [1X02]  11.43,95.25 0 top
JP2  [1X01]  76.2,63.5 0 top
LED1  [LED5MM]  58.42,140.97 0 top
Q1  1.8432MHz  [Q]  95.25,135.89 0 top
QG1  [DIL14S]  76.2,138.43 180 top
R1  [0207/7]  13.97,105.41 90 top
R2  [0207/7]  8.89,105.41 270 top
R3  [0207/7]  46.99,138.43 180 top
R4  [0207/7]  17.78,139.7 270 top
R5  [0207/7]  46.99,129.54 180 top
R6  [0207/7]  59.69,130.81 90 top
R7  [0207/7]  46.99,142.24 180 top
R8  [0207/7]  54.61,130.81 270 top
R9  [0207/7]  17.78,125.73 270 top
R10  [0207/7]  46.99,133.35 0 top
R11  [0207/7]  116.84,63.5 180 top
R12  [0207/7]  116.84,58.42 180 top
R13  [0207/7]  116.84,53.34 180 top
U1  W65C02SP  [DIP-40]  29.21,115.57 270 top
U2  [DIP-28]  95.25,107.95 270 top
U3  [DIP-40]  119.38,115.57 270 top
U$1  CXK58258AP-20  [DIL28-3]  74.93,106.68 270 top
U$2  SOLDERPAD  [SOLDERPAD]  76.2,38.1 0 top
U$3  SOLDERPAD2  [SOLDERPAD2]  41.91,36.83 0 top
UART1  [1X08]  134.62,71.12 90 top
VIA1_CA  [1X02]  134.62,140.97 270 top
VIA1_CB  [1X02]  134.62,87.63 90 top
VIA1_PA  [1X08]  134.62,125.73 270 top
VIA1_PB  [1X08]  134.62,102.87 270 top
X1  [KK-156-4]  8.89,74.93 90 top

## Tracks (layer width: path | path; a pad name or v marks a point on that pad's centre or on a via)
!IOSEL2
  Bottom 0.254: U$2.P$31 127.64,44.45 127,43.81 127,40.64 13.34,40.64 10.16,43.81 10.16,60.96 IC5.10
!ML  (via drill 0.61)
  Top 0.254: v14.61,48.26 4.45,58.42 v4.45,74.93
  Bottom 0.254: U$2.P$19 52.7,46.35 31.12,46.35 29.21,48.26 v14.61,48.26 | v4.45,74.93 1.91,77.47 1.91,127 20.32,127 U1.5
!READ  (via drill 0.61)
  Top 0.254: IC2.6 66.67,56.52 | 66.67,56.52 v70.48,52.7 | v74.93,107.95 73.66,106.68 73.66,72.39 74.3,71.75 74.3,70.48 73.66,69.85 66.67,69.85 66.67,56.52
  Bottom 0.254: U$2.P$11 79.38,52.7 v70.48,52.7 | v74.93,107.95 U$1.22
!RESET  (via drill 0.61)
  Top 0.254: U$2.P$15 v97.79,114.3 97.16,114.94 97.16,119.38 98.42,119.38 100.97,116.84 103.5,116.84 104.14,117.47 104.14,119.38 112.39,119.38 v116.2,123.19 | v83.19,137.16 86.36,133.99 86.36,116.84 U2.4
  Bottom 0.254: IC7.12 15.24,132.08 30.48,132.08 U1.40 38.73,136.52 82.55,136.52 v83.19,137.16 | v97.79,114.3 96.52,115.57 U2.4 | v116.2,123.19 U3.34
!VP  (via drill 0.61, 0.8 pad 1.27)
  Top 0.254: U$2.P$20 55.88,48.26 55.88,54.61 57.79,56.52 v57.79,74.3 | v32.39,80.01 31.75,80.64 31.75,128.27 U1.1
  Top 1.016: U1.1 21.59,140.33 24.13,140.33 v24.13,142.24
  Bottom 0.254: v57.79,74.3 46.99,74.3 41.27,80.01 v32.39,80.01
!VRAM0
  Bottom 0.254: IC5.11 22.86,59.69 71.12,59.69 IC2.9
!VRAM1
  Bottom 0.254: IC5.13 37.47,56.52 45.09,56.52 45.72,57.15 73.66,57.15 74.3,57.78 74.3,60.96 IC2.10
!WRITE  (via drill 0.61)
  Top 0.254: U$2.P$12 88.27,46.35 v88.27,67.31 88.27,81.28 86.36,83.19 86.36,90.81 85.72,91.44 85.72,99.69 86.36,100.33 86.36,106.68 v85.09,107.95 | U$1.27 81.28,118.11 v81.28,110.49
  Bottom 0.254: v88.27,67.31 66.04,67.31 IC2.3 | v81.28,110.49 83.82,107.95 v85.09,107.95
A0  (via drill 0.61)
  Top 0.254: U$3.P$1 15.88,46.35 15.88,91.44 | 15.88,91.44 v15.88,99.06 15.88,114.3 15.24,114.94 15.24,118.74 15.88,119.38 21.59,119.38 U1.9 | U$1.10 69.22,98.42 v69.22,88.27 | 15.88,91.44 v16.51,91.44 | v82.55,88.27 82.55,90.17 v83.19,90.81 83.19,83.82 v85.72,81.28 | U3.38 123.83,133.35 123.83,102.23 123.19,101.6 123.19,81.91 v123.83,81.28
  Bottom 0.254: IC1.10 45.09,99.69 38.1,99.69 37.47,99.06 v15.88,99.06 | v16.51,91.44 22.23,91.44 24.77,88.9 68.58,88.9 v69.22,88.27 v82.55,88.27 | U2.13 86.36,91.44 83.82,91.44 v83.19,90.81 | v85.72,81.28 v123.83,81.28
A1  (via drill 0.61)
  Top 0.254: v26.67,54.61 27.3,55.24 27.3,93.98 25.4,95.88 25.4,101.6 | 25.4,101.6 25.4,111.76 U1.10 | v84.45,90.17 v84.45,100.97 83.82,101.6 83.82,130.81 v85.09,132.08 | v29.84,101.6 25.4,101.6
  Bottom 0.254: U$3.P$2 13.34,47.62 13.34,54.61 v26.67,54.61 | 69.85,101.6 59.69,101.6 59.05,102.23 46.36,102.23 IC1.9 44.45,101.6 v29.84,101.6 | U$1.9 69.85,101.6 | v84.45,90.17 U2.14 | v84.45,100.97 83.82,101.6 69.85,101.6 | U3.37 126.36,131.44 113.03,131.44 112.39,132.08 v85.09,132.08
A2  (via drill 0.61)
  Top 0.254: U$3.P$3 20.32,44.45 20.32,41.27 20.95,40.64 25.4,40.64 25.4,46.99 24.77,47.62 24.77,109.85 U1.11 20.32,114.3 20.32,116.84 22.23,116.84 22.86,116.2 | v29.84,104.14 26.04,107.95 26.04,113.03 22.86,116.2 | v66.67,105.41 63.5,102.23 v63.5,91.44 | v48.26,91.44 47.62,92.07 47.62,103.5 IC1.8 | U3.36 128.91,130.18 128.91,139.7 123.83,144.78 35.56,144.78 v35.56,134.62 | v29.21,128.27 22.86,121.92 22.86,116.2
  Bottom 0.254: IC1.8 45.09,104.78 38.1,104.78 37.47,104.14 v29.84,104.14 | v66.67,105.41 U$1.8 | v48.26,91.44 v63.5,91.44 | v29.21,128.27 v35.56,134.62
A3  (via drill 0.61)
  Top 0.254: U$3.P$4 19.69,46.35 19.69,108.58 U1.12 | v66.67,107.95 64.77,109.85 64.77,114.3 | 64.77,114.3 62.23,116.84 59.05,116.84 59.05,124.46 60.96,126.36 60.96,127.63 60.33,128.27 56.52,128.27 56.52,121.28 47.62,112.39 47.62,109.85 IC1.7 | v72.39,130.18 69.22,130.18 69.22,118.74 64.77,114.3
  Bottom 0.254: IC1.7 45.09,107.31 38.1,107.31 37.47,106.68 20.95,106.68 20.32,107.31 20.32,110.49 U1.12 | v66.67,107.95 U$1.7 | U3.35 126.36,126.36 113.03,126.36 112.39,127 100.97,127 97.79,130.18 v72.39,130.18
A4  (via drill 0.61)
  Top 0.254: U$3.P$5 24.13,105.41 U1.13 | v68.58,78.74 68.58,85.72 67.31,87 67.31,104.78 67.94,105.41 67.94,108.58 v67.31,109.22
  Bottom 0.254: U1.13 22.86,109.22 37.47,109.22 38.1,109.85 45.09,109.85 IC1.6 48.26,110.49 49.53,109.22 v67.31,109.22 69.85,109.22 U$1.6 | IC4.1 96.52,77.47 87,77.47 85.72,78.74 v68.58,78.74
A5  (via drill 0.61)
  Top 0.254: U$1.5 76.83,113.03 76.83,112.39 77.47,111.76 76.83,111.12 76.83,97.16 77.47,96.52 80.64,96.52 80.64,87 | v80.64,73.66 80.64,87 | v22.86,45.72 23.5,46.35 23.5,87 | 23.5,87 23.5,103.5 U1.14 | v75.56,87 80.64,87 | 23.5,87 v22.86,87
  Bottom 0.254: v80.64,73.66 81.28,73.03 98.42,73.03 IC4.2 | U$3.P$6 25.4,45.72 v22.86,45.72 | IC1.5 45.09,112.39 38.1,112.39 37.47,111.76 20.32,111.76 19.69,111.12 19.69,105.41 U1.14 | v22.86,87 v75.56,87
A6  (via drill 0.61)
  Top 0.254: U$3.P$7 25.4,48.26 25.4,93.34 v26.04,93.98 | U$1.4 67.31,111.76 67.31,110.49 68.58,109.22 68.58,88.9 67.94,88.27 67.94,87.63 69.85,85.72 v69.85,72.39
  Bottom 0.254: v26.04,93.98 19.69,93.98 15.24,98.42 | 15.24,98.42 12.7,100.97 12.7,102.87 19.05,102.87 | U1.15 19.05,102.87 | IC1.4 45.09,114.94 38.1,114.94 37.47,114.3 20.95,114.3 19.05,112.39 19.05,102.87 | IC4.3 96.52,72.39 v69.85,72.39 35.56,72.39 22.86,85.09 21.59,85.09 15.24,91.44 15.24,98.42
A7  (via drill 0.61)
  Top 0.254: v18.41,100.33 v18.41,46.99 | v29.84,105.41 v29.84,116.84 | v65.41,118.11 64.13,116.84 63.5,116.84 63.5,117.47 62.87,118.11 62.87,127 60.96,128.91 55.88,128.91 55.88,126.36 55.24,125.73 48.9,125.73 48.26,126.36 46.99,125.09 46.99,124.46 47.62,123.83 47.62,120.02 IC1.3
  Bottom 0.254: U$3.P$8 29.21,46.99 v18.41,46.99 | v18.41,100.33 U1.16 24.77,100.33 v29.84,105.41 | IC1.3 45.09,117.47 38.1,117.47 37.47,116.84 v29.84,116.84 | v65.41,118.11 U$1.3
A8  (via drill 0.61)
  Top 0.254: U$3.P$9 29.21,49.53 27.94,49.53 27.94,94.61 26.67,95.88 v26.67,96.52 31.12,100.97 31.12,123.83 v30.48,124.46 | v49.53,115.57 48.26,116.84 v48.26,125.09
  Bottom 0.254: U$1.25 77.47,114.3 69.85,114.3 68.58,115.57 IC1.25 v49.53,115.57 | v26.67,96.52 25.4,97.79 U1.17 | v48.26,125.09 38.1,125.09 37.47,124.46 v30.48,124.46
A9  (via drill 0.61)
  Top 0.254: v66.04,113.03 69.85,116.84 76.83,116.84 76.83,114.94 U$1.24 | U$3.P$10 35.56,45.72 v35.56,53.34 | v29.21,92.71 v29.21,54.61 | v52.7,112.39 48.26,107.95 48.26,101.6 v48.9,100.97
  Bottom 0.254: v66.04,113.03 IC1.24 60.33,112.39 v52.7,112.39 | v35.56,53.34 34.29,54.61 v29.21,54.61 | U1.18 26.67,95.25 v29.21,92.71 33.02,96.52 37.47,96.52 40,99.06 46.99,99.06 v48.9,100.97
A10  (via drill 0.61)
  Top 0.254: U$3.P$11 36.83,46.99 36.83,53.34 35.56,54.61 34.29,54.61 34.29,51.43 32.39,49.53 30.48,49.53 v30.48,82.55 v30.48,90.17 | v50.8,105.41 52.07,104.14 v52.07,83.19 | v74.93,105.41 74.3,104.78 74.3,86.36 v74.93,85.72
  Bottom 0.254: v30.48,90.17 27.94,92.71 U1.19 | v50.8,105.41 IC1.21 | v30.48,82.55 38.1,82.55 38.73,81.91 50.8,81.91 v52.07,83.19 72.39,83.19 v74.93,85.72 | v74.93,105.41 U$1.21
A11  (via drill 0.61)
  Top 0.254: v68.58,110.49 69.85,109.22 73.03,109.22 | v74.93,109.22 73.03,109.22 | U$3.P$12 43.81,46.35 43.81,71.75 v41.27,74.3 | 73.03,109.22 73.03,86.36 v72.39,85.72
  Bottom 0.254: v68.58,110.49 IC1.23 | v74.93,109.22 76.2,110.49 U$1.23 | v41.27,74.3 38.1,77.47 31.75,77.47 23.5,85.72 | 23.5,85.72 22.86,85.72 21.59,87 U1.20 | 23.5,85.72 v72.39,85.72
A12  (via drill 0.61)
  Top 0.254: U$3.P$13 v44.45,78.1 43.18,79.38 43.18,92.71 | 43.18,92.71 43.18,118.74 v42.55,119.38 42.55,127.63 v41.91,128.27 | v67.94,120.65 66.67,121.92 v66.67,127.63 | 43.18,92.71 v42.55,92.71
  Bottom 0.254: v44.45,78.1 41.27,81.28 IC5.23 | IC1.2 45.09,120.02 43.18,120.02 v42.55,119.38 | v67.94,120.65 U$1.2 | v66.67,127.63 66.04,128.27 v41.91,128.27 | v42.55,92.71 U1.22
A13  (via drill 0.61)
  Top 0.254: v64.13,118.11 65.41,119.38 65.41,127.63 69.22,131.44 73.66,131.44 73.66,123.19 U$1.26 | U$3.P$14 45.09,46.35 45.09,69.85 | 45.09,69.85 45.09,73.66 v45.72,74.3 | v48.9,93.98 49.53,93.34 49.53,74.3 | 49.53,74.3 49.53,71.12 48.26,69.85 45.09,69.85 | v56.52,118.11 55.24,116.84 55.24,95.88 55.88,95.25 55.88,80.64 49.53,74.3
  Bottom 0.254: v64.13,118.11 IC1.26 v56.52,118.11 | v45.72,74.3 41.27,78.74 IC5.22 | U1.23 38.1,93.98 v48.9,93.98
A14  (via drill 0.61)
  Top 0.254: U$3.P$15 46.36,47.62 v46.36,53.34 | v42.55,55.24 41.27,56.52 41.27,68.58 38.73,71.12 38.73,74.3 IC5.21 38.73,78.1 38.73,95.88 U1.24 38.1,99.06 38.1,128.91 v38.73,129.54 | U$1.1 70.48,123.83 v70.48,127.63
  Bottom 0.254: v46.36,53.34 44.45,55.24 v42.55,55.24 | v70.48,127.63 67.31,130.81 40,130.81 v38.73,129.54
A15  (via drill 0.61)
  Top 0.254: IC5.20 34.92,75.56 34.92,98.42 U1.25 | v85.09,102.23 85.72,101.6 85.72,100.97 85.09,100.33 85.09,90.81 85.72,90.17 85.72,82.55 87,81.28 v87,76.2
  Bottom 0.254: U$1.20 79.38,102.23 v85.09,102.23 | v87,76.2 85.09,74.3 81.28,74.3 80.64,74.93 59.69,74.93 57.79,73.03 37.47,73.03 IC5.20
ACIA1_CS  (via drill 0.61)
  Top 0.254: v116.2,62.23 115.57,62.86 115.57,109.85 116.2,110.49 116.2,113.03 114.94,114.3 100.97,114.3 100.97,115.57 v99.7,116.84
  Bottom 0.254: IC4.11 109.22,62.23 v116.2,62.23 | v99.7,116.84 98.42,116.84 97.16,118.11 U2.3
BE
  Bottom 0.254: R5.2 40,129.54 38.73,128.27 U1.36
CPSP  (via drill 0.61)
  Top 0.254: v57.15,52.07 U$2.P$18 | v33.02,52.07 33.66,52.7 33.66,130.18 U1.38 38.1,134.62 38.1,138.43 R3.2
  Bottom 0.254: v33.02,52.07 v57.15,52.07
D0  (via drill 0.61)
  Top 0.254: U$2.P$23 107.95,53.34 106.05,55.24 106.05,93.98 102.87,97.16 U2.18 | v92.08,99.06 v92.08,120.65
  Bottom 0.254: U1.33 43.18,120.65 44.45,121.92 47.62,121.92 48.26,121.28 59.05,121.28 59.69,121.92 92.08,121.92 | 92.08,121.92 113.67,121.92 114.94,120.65 U3.33 | IC1.11 46.36,98.42 59.05,98.42 59.69,99.06 68.58,99.06 69.85,97.79 U$1.11 71.75,98.42 76.83,98.42 77.47,99.06 v92.08,99.06 101.6,99.06 U2.18 | v92.08,120.65 92.08,121.92
D1  (via drill 0.61)
  Top 0.254: U$2.P$24 110.49,74.3 109.22,75.56 v109.22,96.52 | v54.61,118.11 v54.61,95.25 | v100.33,102.87 99.06,104.14 99.06,114.94 98.42,115.57 v98.42,118.11
  Bottom 0.254: v109.22,96.52 105.41,100.33 U2.19 v100.33,102.87 | IC1.12 46.99,96.52 54.61,96.52 | 54.61,96.52 68.58,96.52 69.85,95.25 U$1.12 | U1.32 43.18,118.11 44.45,119.38 54.61,119.38 | 98.42,119.38 123.83,119.38 125.09,118.11 U3.32 | 98.42,119.38 54.61,119.38 | v54.61,95.25 54.61,96.52 | 54.61,119.38 v54.61,118.11 | 98.42,119.38 v98.42,118.11
D2  (via drill 0.61)
  Top 0.254: v106.68,49.53 102.23,53.97 102.23,78.74 101.6,79.38 101.6,92.71 | 101.6,92.71 101.6,101.6 102.23,102.23 | U2.20 102.23,102.23 | 101.6,92.71 v100.97,92.71 | v99.7,115.57 100.33,114.94 100.33,104.14 102.23,102.23
  Bottom 0.254: U1.31 37.47,116.2 43.81,116.2 44.45,116.84 97.16,116.84 98.42,115.57 v99.7,115.57 100.97,115.57 102.23,116.84 113.67,116.84 114.94,115.57 U3.31 | IC1.13 58.42,92.71 59.69,93.98 68.58,93.98 69.85,92.71 U$1.13 71.75,93.34 76.83,93.34 77.47,93.98 96.52,93.98 97.79,92.71 v100.97,92.71 | U$2.P$25 107.95,49.53 v106.68,49.53
D3  (via drill 0.61)
  Top 0.254: v63.5,114.3 62.87,113.66 62.87,92.07 IC1.15 | U$2.P$26 114.3,45.72 114.3,88.9 | 114.3,88.9 114.3,99.69 112.39,101.6 110.49,101.6 | 110.49,101.6 104.78,101.6 104.78,104.14 103.5,105.41 U2.21 | v114.94,113.03 113.03,111.12 113.03,109.85 112.39,109.22 110.49,109.22 110.49,101.6 | 114.3,88.9 v113.67,88.9
  Bottom 0.254: IC1.15 61.59,89.53 69.22,89.53 69.85,88.9 77.47,88.9 U$1.15 79.38,89.53 83.82,89.53 85.09,88.27 113.03,88.27 v113.67,88.9 | U1.30 37.47,113.66 43.81,113.66 44.45,114.3 v63.5,114.3 | v114.94,113.03 U3.30
D4  (via drill 0.61)
  Top 0.254: U$2.P$27 114.94,47.62 v114.94,110.49 | U$1.16 76.2,95.25 v76.2,111.76
  Bottom 0.254: IC1.16 68.58,92.71 69.85,91.44 77.47,91.44 U$1.16 | U3.29 v114.94,110.49 113.67,111.76 101.6,111.76 | U2.22 101.6,109.22 101.6,111.76 | U1.29 37.47,111.12 43.81,111.12 44.45,111.76 52.07,111.76 52.7,111.12 59.05,111.12 59.69,111.76 v76.2,111.76 101.6,111.76
D5  (via drill 0.61)
  Top 0.254: v49.53,107.95 53.34,104.14 v53.34,95.25 | U$2.P$28 121.92,45.72 121.92,104.78 121.28,105.41 v121.28,107.95 | v104.78,96.52 104.14,97.16 104.14,103.5 103.5,104.14 101.6,104.14 101.6,109.22 U2.23
  Bottom 0.254: U1.28 37.47,108.58 43.81,108.58 44.45,109.22 48.26,109.22 v49.53,107.95 | v53.34,95.25 54.61,93.98 58.42,93.98 59.69,95.25 IC1.17 61.59,94.61 69.22,94.61 69.85,93.98 76.2,93.98 77.47,95.25 U$1.17 80.01,96.52 93.98,96.52 95.25,97.79 97.79,97.79 99.06,96.52 v104.78,96.52 | U3.28 v121.28,107.95 114.94,107.95 113.67,109.22 104.14,109.22 U2.23
D6  (via drill 0.61)
  Top 0.254: U$2.P$29 122.56,45.08 v122.56,105.41 | U2.24 104.14,111.76 v104.14,106.68 | U$1.18 80.64,99.69 v80.64,106.68
  Bottom 0.254: IC1.18 61.59,97.16 69.22,97.16 69.85,96.52 77.47,96.52 U$1.18 | U3.27 v122.56,105.41 121.28,106.68 v104.14,106.68 v80.64,106.68 44.45,106.68 43.81,106.04 37.47,106.04 U1.27
D7  (via drill 0.61)
  Top 0.254: U$2.P$30 132.08,50.8 132.08,57.15 136.53,61.59 136.53,102.23 135.89,102.87 U3.26 | v90.81,113.03 90.17,112.39 v90.17,105.41
  Bottom 0.254: IC1.19 61.59,99.69 69.22,99.69 69.85,99.06 76.2,99.06 76.83,99.69 | 76.83,99.69 77.47,100.33 U$1.19 | U1.26 37.47,103.5 43.81,103.5 44.45,104.14 84.45,104.14 | 84.45,104.14 86.36,102.23 86.36,99.69 76.83,99.69 | U2.25 100.33,113.03 v90.81,113.03 | 88.9,104.14 v90.17,105.41 | 84.45,104.14 88.9,104.14 | U3.26 126.36,103.5 113.03,103.5 112.39,104.14 88.9,104.14
IO0  (via drill 0.61)
  Top 0.254: U$2.P$3 68.58,44.45 68.58,33.66 69.22,33.02 119.38,33.02 v119.38,60.32
  Bottom 0.254: v119.38,60.32 108.58,71.12 IC4.15
IO1  (via drill 0.61)
  Top 0.254: U$2.P$4 71.12,44.45 71.12,36.19 71.75,35.56 111.76,35.56 v111.76,64.77
  Bottom 0.254: IC4.14 v111.76,64.77
IO2
  Top 0.254: U$2.P$5 73.66,44.45 73.66,38.73 74.3,38.1 109.22,38.1 109.22,54.61 109.86,55.24 109.86,64.13 IC4.13
IO3  (via drill 0.61)
  Top 0.254: U$2.P$6 76.2,45.72 76.2,55.88 v80.01,63.5
  Bottom 0.254: v80.01,63.5 81.28,64.77 106.68,64.77 IC4.12
IO5  (via drill 0.61)
  Top 0.254: v77.47,55.24 U$2.P$7
  Bottom 0.254: v77.47,55.24 78.11,54.61 96.52,54.61 99.06,57.15 106.68,57.15 IC4.10
IO7  (via drill 0.61)
  Top 0.254: U$2.P$8 87,51.43 v87,57.78
  Bottom 0.254: v87,57.78 88.9,59.69 99.06,59.69 IC4.7
IO_SEL  (via drill 0.61)
  Top 0.254: v78.74,46.99 80.64,48.89 80.64,61.59 IC3.4 84.45,65.41 84.45,71.75 81.28,74.93 81.28,87 | v82.55,120.65 82.55,91.44 81.28,90.17 81.28,87 | 81.28,87 v81.92,87
  Bottom 0.254: U$2.P$2 67.31,46.99 v78.74,46.99 | v82.55,120.65 U2.2 | U3.24 129.54,95.25 135.89,95.25 136.53,94.61 136.53,87.63 83.19,87.63 82.55,87 v81.92,87
IRQ0  (via drill 0.61)
  Top 0.254: IC6.1 46.99,86.36 43.81,89.53 43.81,128.27 45.09,129.54 45.09,140.33 R7.2 | U2.26 100.97,120.02 v100.97,137.16
  Bottom 0.254: v100.97,137.16 98.42,139.7 52.7,139.7 51.44,140.97 44.45,140.97 R7.2
IRQ1  (via drill 0.61)
  Top 0.254: v42.55,68.58 40,71.12 40,128.27 44.45,132.72 44.45,139.06 41.91,141.61 41.91,142.88 42.55,143.51 53.34,143.51 | 53.34,143.51 53.34,128.27 R8.2 | U3.21 123.83,93.34 123.83,100.97 125.73,102.87 125.73,131.44 126.36,132.08 128.27,132.08 128.27,139.06 123.19,144.14 53.34,144.14 53.34,143.51
  Bottom 0.254: v42.55,68.58 IC6.2
IRQ2  (via drill 0.61)
  Top 0.254: v64.77,48.26 59.05,53.97 v59.05,60.96
  Bottom 0.254: U$2.P$9 78.74,48.26 v64.77,48.26 | v59.05,60.96 57.79,62.23 52.7,62.23 51.44,63.5 IC6.4 45.72,63.5 44.45,62.23 19.69,62.23 19.69,80.01 7.62,92.07 6.35,92.07 6.35,116.2 6.99,116.84 12.7,116.84 R9.2
IRQ3  (via drill 0.61)
  Top 0.254: v49.53,49.53 48.9,50.16 48.9,59.05 IC6.5 | R10.1 38.1,133.35 38.1,130.18 37.47,129.54 34.29,129.54 34.29,58.42 35.56,57.15 39.37,57.15 v39.37,49.53
  Bottom 0.254: U$2.P$10 80.01,49.53 v49.53,49.53 48.26,48.26 40.64,48.26 v39.37,49.53
N$1
  Bottom 0.254: IC5.9 27.94,69.85 58.42,69.85 63.5,64.77 80.01,64.77 81.28,66.04 IC3.3
N$2
  Bottom 0.254: IC5.17 38.1,67.31 53.34,67.31 IC6.13
N$3
  Bottom 0.254: IC5.16 38.1,64.77 53.34,64.77 IC6.12
N$4
  Bottom 0.254: IC5.15 37.47,61.59 45.09,61.59 45.72,62.23 51.44,62.23 52.7,60.96 IC6.10
N$5
  Top 0.254: IC5.14 40.64,58.42 40.64,41.27 41.27,40.64 50.8,40.64 50.8,54.61 IC6.9
N$6  (via drill 0.61)
  Top 0.254: IC6.8 56.52,57.78 v56.52,107.95
  Bottom 0.254: IC1.22 v56.52,107.95
N$9
  Bottom 0.254: IC2.2 66.04,69.85 81.28,69.85 IC3.2
N$10
  Top 0.254: Q1.2 93.98,132.08 88.9,132.08 88.9,111.76 U2.6
N$11
  Top 0.254: Q1.1 89.53,127.63 89.53,109.85 U2.7
N$12  (via drill 0.61)
  Top 0.254: v14.61,57.15 14.61,100.33 15.24,100.97 15.24,113.66 14.61,114.3 14.61,120.65 20.32,126.36 20.32,129.54 U1.4
  Bottom 0.254: IC6.6 46.36,57.78 38.73,57.78 38.1,57.15 v14.61,57.15
N$15
  Top 0.254: IC2.8 70.48,57.78 70.48,64.13 IC2.12 IC2.13
N$16
  Top 0.254: JP2.1 IC2.11
N$17
  Bottom 0.254: VIA1_PA.1 113.03,134.62 U3.2
N$18
  Top 0.254: R2.1 8.89,114.3 C11.- 10.16,132.08 IC7.13
  Bottom 0.254: R1.2 R2.1
N$19
  Top 0.254: R2.2 10.16,100.33 JP1.1
N$20
  Bottom 0.254: VIA1_PA.2 113.67,132.08 112.39,133.35 U3.3
N$21
  Bottom 0.254: VIA1_PA.3 113.03,129.54 U3.4
N$22
  Top 0.254: LED1.K R6.2
N$23
  Bottom 0.254: VIA1_PA.4 113.67,127 112.39,128.27 U3.5
N$24
  Bottom 0.254: VIA1_PA.5 113.03,124.46 U3.6
N$25
  Bottom 0.254: VIA1_PA.6 114.94,121.92 113.67,123.19 U3.7
N$26
  Bottom 0.254: VIA1_PA.7 125.09,119.38 124.46,120.02 112.39,120.02 U3.8
N$27
  Bottom 0.254: VIA1_PA.8 114.94,116.84 113.67,118.11 U3.9
N$28
  Bottom 0.254: VIA1_PB.1 132.08,114.3 113.03,114.3 U3.10
N$29
  Bottom 0.254: VIA1_PB.2 132.08,111.76 114.94,111.76 113.67,113.03 U3.11
N$30
  Bottom 0.254: VIA1_PB.3 132.08,109.22 114.94,109.22 113.67,110.49 U3.12
N$31  (via drill 0.61)
  Top 0.254: v113.67,101.6 113.03,102.23 113.03,106.68 U3.13
  Bottom 0.254: VIA1_PB.4 132.08,101.6 v113.67,101.6
N$32
  Bottom 0.254: VIA1_PB.5 136.53,103.5 136.53,105.41 128.91,105.41 127.64,104.14 113.67,104.14 112.39,105.41 U3.14
N$33
  Bottom 0.254: VIA1_PB.6 111.12,99.06 110.49,99.69 110.49,102.87 U3.15
N$34  (via drill 0.61)
  Top 0.254: VIA1_PB.7 125.09,96.52 v125.09,100.33
  Bottom 0.254: U3.16 v125.09,100.33
N$35
  Bottom 0.254: VIA1_PB.8 115.57,93.98 U3.17
N$36
  Bottom 0.254: VIA1_CA.1 130.81,138.43 U3.40
N$37
  Bottom 0.254: VIA1_CA.2 130.81,135.89 U3.39
N$38  (via drill 0.61)
  Top 0.254: v113.03,84.45 113.03,80.01 111.76,78.74 110.49,78.74 110.49,93.98 U3.18
  Bottom 0.254: VIA1_CB.1 132.72,84.45 v113.03,84.45
N$39
  Bottom 0.254: VIA1_CB.2 132.08,91.44 113.03,91.44 U3.19
N$40  (via drill 0.61)
  Top 0.254: v89.53,85.09 88.9,85.72 88.9,93.34 88.27,93.98 86.36,93.98 86.36,99.06 U2.10
  Bottom 0.254: UART1.8 132.08,82.55 114.94,82.55 114.3,81.91 92.71,81.91 v89.53,85.09
N$41  (via drill 0.61)
  Top 0.254: v95.89,78.74 95.25,79.38 v95.25,95.25
  Bottom 0.254: UART1.7 133.99,76.83 105.41,76.83 103.5,78.74 v95.89,78.74 | U2.12 v95.25,95.25
N$42  (via drill 0.61)
  Top 0.254: CTS.2 134.62,60.96 UART1.1 | v99.06,77.47 v99.06,100.33
  Bottom 0.254: U2.9 90.17,100.33 v99.06,100.33 | v99.06,77.47 101.6,74.93 123.19,74.93 129.54,68.58 135.89,68.58 136.53,67.94 136.53,62.23 UART1.1
N$43  (via drill 0.61)
  Top 0.254: v110.49,96.52 109.86,95.88 109.86,76.2 111.76,74.3 v111.76,70.48
  Bottom 0.254: 128.91,60.32 133.35,64.77 UART1.2 | 128.91,60.32 DSR.2 | U2.17 109.22,95.25 v110.49,96.52 | v111.76,70.48 121.92,60.32 128.91,60.32
N$44  (via drill 0.61)
  Top 0.254: U2.16 104.78,90.81 v104.78,76.2 | v123.83,75.56 127,72.39 DCD.2
  Bottom 0.254: DCD.2 130.81,67.31 UART1.3 | v104.78,76.2 105.41,75.56 v123.83,75.56
N$45  (via drill 0.61)
  Top 0.254: v90.81,85.09 89.53,86.36 89.53,95.88 U2.11
  Bottom 0.254: UART1.4 132.72,71.75 132.72,76.2 135.89,76.2 136.53,76.83 136.53,83.19 114.3,83.19 113.67,82.55 93.34,82.55 v90.81,85.09
N$46  (via drill 0.61)
  Top 0.254: v92.08,85.09 90.17,87 90.17,102.87 U2.8
  Bottom 0.254: UART1.5 135.25,73.03 136.53,73.03 137.16,73.66 137.16,83.82 113.67,83.82 113.03,83.19 93.98,83.19 v92.08,85.09
N$47
  Bottom 0.254: DCD.1 R11.1
N$48
  Bottom 0.254: DSR.1 R12.1
N$49
  Bottom 0.254: CTS.1 R13.1
OSC
  Bottom 0.254: QG1.8 65.41,131.44 37.47,131.44 U1.37
PHI1  (via drill 0.61)
  Top 0.254: U$2.P$22 104.14,45.72 99.06,45.72 99.06,41.27 98.42,40.64 91.44,40.64 91.44,54.61 92.08,55.24 92.08,61.59 91.44,62.23 92.08,62.86 92.08,69.22 91.44,69.85 93.34,71.75 93.34,123.83 99.06,126.36 v99.06,137.8
  Bottom 0.254: v99.06,137.8 98.42,138.43 76.83,138.43 76.2,139.06 52.07,139.06 51.44,139.7 27.94,139.7 U1.3
PHI2  (via drill 0.61)
  Top 0.254: 62.87,61.59 v62.87,53.97 | IC2.4 62.87,61.59 | IC2.1 62.87,69.22 62.87,61.59 | U2.27 101.6,121.92 101.6,135.25 v102.23,135.89 102.23,138.43 100.97,138.43 99.7,137.16 99.7,125.73 96.52,122.55 96.52,114.3 97.16,113.66 97.16,46.35 U$2.P$14
  Bottom 0.254: U$2.P$14 85.72,53.97 v62.87,53.97 | U1.39 v102.23,135.89 103.5,137.16 113.03,137.16 119.38,143.51 137.16,143.51 137.16,101.6 135.89,100.33 U3.25
READY
  Top 0.254: U$2.P$17 58.42,44.45 58.42,38.73 57.79,38.1 3.18,38.1 3.18,117.47 9.53,123.83 9.53,133.99 12.7,137.16 17.78,137.16 R4.2
  Bottom 0.254: R4.2 U1.2
RWB  (via drill 0.61)
  Top 0.254: U$2.P$13 v92.71,62.23 v92.71,69.85 93.98,71.12 93.98,95.25 v95.25,96.52 v95.25,123.19
  Bottom 0.254: U1.34 37.47,123.83 43.81,123.83 44.45,124.46 47.62,124.46 48.26,123.83 59.05,123.83 59.69,124.46 95.25,124.46 | 95.25,124.46 101.6,124.46 U2.28 | v92.71,69.85 83.82,69.85 IC3.1 | IC2.5 66.04,62.23 v92.71,62.23 | U3.22 126.36,93.34 113.03,93.34 112.39,93.98 97.79,93.98 v95.25,96.52 | v95.25,123.19 95.25,124.46
SYNC  (via drill 0.61)
  Top 0.254: v117.47,52.07 118.11,52.7 118.11,85.72 120.02,87.63 120.02,128.27 118.75,129.54 102.87,129.54 v102.87,125.73
  Bottom 0.254: U$2.P$16 107.95,52.07 v117.47,52.07 | v102.87,125.73 102.23,125.09 49.53,125.09 47.62,127 25.4,127 U1.7
VCC  (via drill 0.6, 0.61)
  Top 1.016: v103.5,61.59 104.78,62.86 v104.78,71.12 | v116.84,88.9 C9.1 v116.84,73.66 | IC3.14 92.08,73.03 v92.08,78.74 | C3.1 v48.26,83.82 | IC6.14 55.24,71.75 v55.24,75.56 | C4.1 67.31,74.93 67.31,71.12 IC2.14 v72.39,77.47 | C8.1 v100.33,89.53 | U1.6 19.69,123.83 19.69,122.55 U1.8 | v14.61,53.34 8.89,59.05 8.89,68.58 | 8.89,68.58 12.7,72.39 JP1.2 12.7,100.33 6.99,106.04 6.99,114.94 C11.+ | 8.89,68.58 X1.1 | U$1.28 82.55,127 C6.1 82.55,133.35 QG1.14 | 19.69,138.43 19.69,141.61 R4.1 | 19.69,138.43 19.69,131.44 R9.1 18.41,129.54 v18.41,125.73 | 19.69,138.43 IC7.14 | R7.1 R3.1 R10.2 49.21,131.76 | IC1.28 IC1.27 | IC1.1 45.72,128.27 49.21,131.76 | R5.1 49.53,130.81 49.53,131.44 49.21,131.76 | v67.94,132.72 54.61,132.72 R8.1 | v41.27,121.92 v41.27,84.45 | U$2.P$1 63.5,45.72 66.04,46.99 71.12,46.99 74.93,50.8 74.93,55.88 78.74,63.5 v78.74,71.12
  Bottom 1.016: IC4.6 100.97,61.59 v103.5,61.59 | v104.78,71.12 107.31,73.66 IC4.16 v116.84,73.66 | v116.84,88.9 115.57,90.17 U3.20 U2.15 102.23,89.53 v100.33,89.53 | 92.39,79.06 93.34,80.01 C8.1 | 92.39,79.06 v92.08,78.74 | v48.26,83.82 41.27,83.82 | 41.27,83.82 IC5.24 | C4.1 57.15,77.47 v55.24,75.56 50.16,75.56 C3.1 51.44,80.64 66.04,80.64 66.67,80.01 91.44,80.01 92.39,79.06 | v72.39,77.47 C5.1 | C11.+ 9.53,113.66 14.61,113.66 C1.1 U1.8 | C2.1 26.67,53.34 v14.61,53.34 | C7.1 71.12,129.54 71.12,132.72 | 71.12,132.72 71.12,134.62 QG1.14 C10.1 | LED1.A 55.88,142.24 R7.1 48.9,144.14 18.41,144.14 R4.1 | R8.1 53.34,133.35 R10.2 | IC1.28 59.69,123.19 59.05,122.55 48.26,122.55 47.62,123.19 IC1.1 44.45,123.19 43.81,122.55 41.91,122.55 v41.27,121.92 | v67.94,132.72 71.12,132.72 | v18.41,125.73 U1.6 | v41.27,84.45 41.27,83.82 | v78.74,71.12 IC2.14
VIA1_CS  (via drill 0.61)
  Top 0.254: v127,55.88 128.27,57.15 128.27,93.98 U3.23
  Bottom 0.254: v127,55.88 IC4.9
VSS  (via drill 0.6, 0.6 pad 1.02, 0.61, 0.8 pad 1.27)
  Top 1.016: IC5.19 IC5.18 | v32.39,67.94 31.75,67.31 C2.2 | UART1.6 129.54,74.93 v129.54,78.1 | v113.03,78.1 R11.2 R12.2 R13.2 v113.03,49.53 | IC4.5 IC4.4 | v71.12,77.47 U$1.14 | C3.2 v50.8,90.17 | IC3.5 85.72,60.96 v85.72,68.58 85.72,76.83 C5.2 | C8.2 103.5,79.38 v103.5,68.58 | IC2.7 64.13,55.24 64.13,53.34 63.5,52.7 61.59,52.7 61.59,76.83 63.82,79.06 | 63.82,79.06 64.13,79.38 67.31,79.38 C4.2 | R1.1 12.07,103.5 12.07,121.92 11.43,122.55 11.43,123.83 11.75,124.14 | 11.75,124.14 13.34,125.73 IC7.9 | IC7.11 11.43,130.81 11.43,124.46 11.75,124.14 | U3.1 110.49,138.43 C10.2 106.68,135.25 102.23,139.7 84.45,139.7 84.45,138.43 84.14,138.11 | 58.42,102.87 57.79,102.87 57.79,125.09 R6.1 | 58.42,102.87 IC1.20 | 72.71,138.11 74.93,135.89 C7.2 | 72.71,138.11 QG1.7 | U2.1 87.63,134.62 84.14,138.11 | 84.14,138.11 83.82,138.43 73.03,138.43 72.71,138.11 | 63.82,79.06 58.42,84.45 58.42,102.87 | v21.59,145.41 v21.59,142.24
  Bottom 1.016: IC6.7 48.9,53.97 58.42,53.97 | 58.42,53.97 60.96,53.97 62.87,55.88 IC2.7 | IC5.12 27.94,55.88 27.94,53.97 28.57,53.34 29.21,53.34 C2.2 58.42,50.8 58.42,53.97 | IC5.18 36.2,67.94 v32.39,67.94 | IC4.8 102.87,53.34 R13.2 | C8.2 114.3,80.01 114.62,79.69 | 114.62,79.69 116.2,78.1 117.47,78.1 C9.2 119.38,79.38 128.27,79.38 v129.54,78.1 | 114.62,79.69 v113.03,78.1 | IC4.5 IC3.11 | IC3.7 83.19,56.52 85.09,56.52 | 85.09,56.52 87.63,56.52 89.53,58.42 IC3.9 | IC3.5 83.19,60.32 83.82,60.32 85.09,59.05 85.09,56.52 | U1.21 IC1.14 v50.8,90.17 | C3.2 52.7,79.38 65.41,79.38 C4.2 70.48,77.47 | 70.48,77.47 v71.12,77.47 | C5.2 83.19,75.56 81.28,75.56 80.64,76.2 71.75,76.2 70.48,77.47 | v85.72,68.58 IC3.13 90.81,67.94 97.79,67.94 99.7,66.04 IC4.4 100.97,66.04 v103.5,68.58 | IC7.5 6.99,128.91 11.43,128.91 11.75,129.22 | 11.75,129.22 13.34,130.81 IC7.11 | IC7.3 6.99,132.72 8.26,132.72 8.57,132.4 | 11.75,129.22 8.57,132.4 | IC7.1 6.99,137.8 7.62,137.8 8.57,136.84 | 8.57,136.84 8.89,136.52 8.89,132.72 8.57,132.4 | C1.2 19.69,121.28 19.69,124.46 15.88,124.46 14.61,125.73 IC7.9 13.34,125.73 11.43,123.83 6.99,123.83 IC7.7 3.18,123.19 3.18,78.1 6.99,74.3 7.62,74.3 8.89,73.03 X1.2 | R6.1 60.33,126.36 73.03,126.36 73.34,126.68 | C7.2 73.34,126.68 | C6.2 83.19,126.36 73.66,126.36 73.34,126.68 | 8.57,136.84 17.15,145.41 v21.59,145.41 65.41,145.41 QG1.7 | U$2.P$32 130.81,45.72 128.27,48.26 114.3,48.26 v113.03,49.53
(copper drawn outside any net)
  shapes: Top circle x4

## Text on the board
Top: 7414 | CPU | VIA | CA | RAM | ROM | ACIA | PA | PB | CB | TXD | RXD | GND | RTS | DTR | DCD | DCD | DSR | CTS | DSR | CTS | 7421 | 7400 | 7404 | 74138 | 74154 | REICHEL R8 | 6502 MICROCOMPUTER | (C) 2014-2017 A.J.Reichel | 0 1 2 3 4 5 6 7 8 9 0 1 2 3 4 | REVISION F | A B C D E F G H I J K L M N O P Q R S T U V W X Y Z a b c d e f